# EAGLE design scematics (EAGLE 9.6.2)
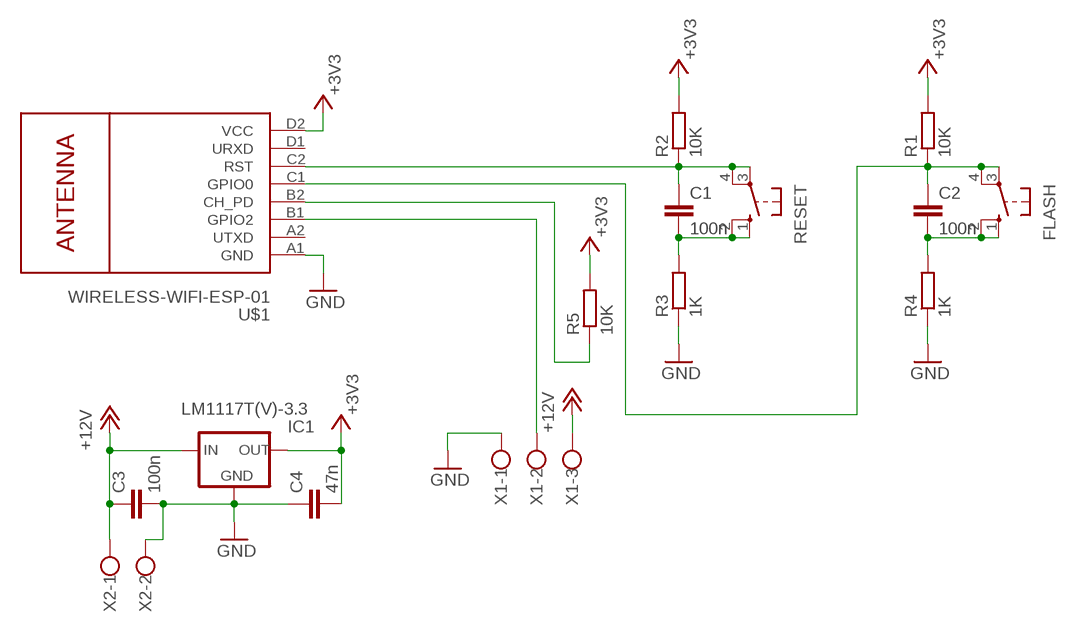
[diagram p0: schematic, sheet 1]

## Parts
C1  100n  C-EU050-030X075  [C050-030X075]
C2  100n  C-EU050-030X075  [C050-030X075]
C3  100n  C-EU050-030X075  [C050-030X075]
C4  47n  C-EU050-030X075  [C050-030X075]
FLASH  10-XX  [B3F-10XX]
IC1  LM1117T(V)-3.3  [TO220V]
R1  10K  R-EU_0207/10  [0207/10]
R2  10K  R-EU_0207/10  [0207/10]
R3  1K  R-EU_0207/10  [0207/10]
R4  1K  R-EU_0207/10  [0207/10]
R5  10K  R-EU_0207/10  [0207/10]
RESET  10-XX  [B3F-10XX]
U$1  WIRELESS-WIFI-ESP-01  [WIRELESS-WIFI-ESP-01]
X1  W237-103  [W237-103]
X2  W237-102  [W237-102]

## Nets
+3V3: C4.2 IC1.2(OUT) R1.2 R2.2 R5.2 U$1.D2(VCC)
+12V: C3.1 IC1.3(IN) X1.3 X2.1
GND: C3.2 C4.1 IC1.1(GND) R3.1 R4.1 U$1.A1(GND) X1.1 X2.2
N$1: C1.1 R2.1 RESET.3(P) RESET.4(P1) U$1.C2(RST)
N$2: C1.2 R3.2 RESET.1(S) RESET.2(S1)
N$3: C2.1 FLASH.3(P) FLASH.4(P1) R1.1 U$1.C1(GPIO0)
N$4: C2.2 FLASH.1(S) FLASH.2(S1) R4.2
N$5: R5.1 U$1.B2(CH_PD)
N$6: U$1.B1(GPIO2) X1.2
Unconnected: U$1.A2(UTXD) U$1.D1(URXD)

## Library data of the parts
C1-C4 = resistor:C-EU: CAPACITOR, European symbol
FLASH RESET = switch-omron:10-XX: OMRON SWITCH; MPN: B3F-1000; OC_FARNELL: 176432; OC_NEWARK: 36M3542
IC1 = lm1117_10:LM1117?-*: 800mA Low-Dropout Linear Regulator Source: http://www.ti.com/lit/ds/symlink/lm1117-n.pdf; MF: Texas Instruments; MPN: LM1117T-3.3; OC_FARNELL: 1469056; OC_NEWARK: 13B5347
R1-R5 = resistor:R-EU_: RESISTOR, European symbol
U$1 = diy-modules:WIRELESS-WIFI-ESP-01: Wireless Wi-Fi ESP-01 Module based on ESP8266 chip Click here to find device on ebay.com <http://www.ebay.com/sch/esp8266+esp+01+transceiver>
X1 = con-wago-500:W237-103: WAGO SCREW CLAMP; MPN: 237-103; OC_FARNELL: unknown; OC_NEWARK: 18M7116
X2 = con-wago-500:W237-102: WAGO SCREW CLAMP; MPN: 237-102; OC_FARNELL: unknown; OC_NEWARK: 70K9898

## Board
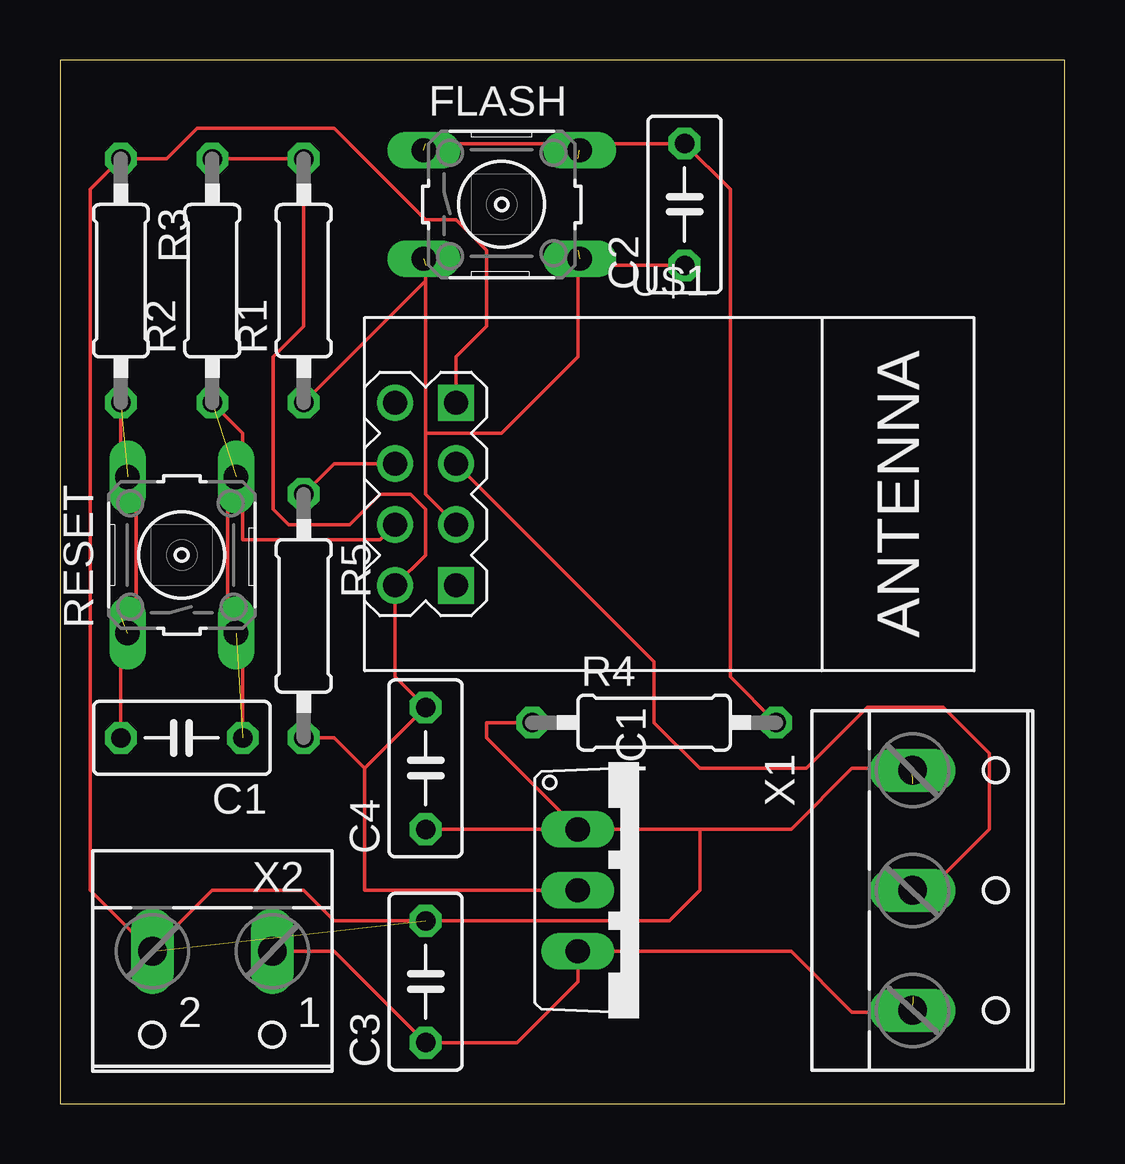
[diagram p1: board, top side]

Size 41.89 x 43.48 mm. Coordinates in mm from the lower left corner, seen from the top.
Outline: 0,0 41.89,0 41.89,43.48 0,43.48 0,0
Copper layers (1*16): Top 0.035mm / dielectric 1.5mm / Bottom 0.035mm
Design rules "default": minimum track width 6mil, minimum drill 0.35mm, track to track 6mil, track to pad 6mil, pad to pad 6mil, via to via 6mil, smd to smd 6mil, copper to edge 40mil, drill to drill 6mil, minimum pad ring 10mil, minimum via ring 8mil, stop-mask expansion 4mil, vias tented up to drill 0mil, thermal gap 10mil

### Footprints (pad centres in the part's own frame; a part is rotated, then mirrored left to right if it is on the bottom)
C050-030X075 = drill 0.813 octagon: 1 -2.54,0; 2 2.54,0
B3F-10XX = drill 1.016 long: 1 -3.251,2.261; 2 3.251,2.261; 3 -3.251,-2.261; 4 3.251,-2.261
TO220V = drill 1.016 long: 1 -2.54,-2.54; 2 0,-2.54; 3 2.54,-2.54
0207/10 = drill 0.813 octagon: 1 -5.08,0; 2 5.08,0
WIRELESS-WIFI-ESP-01 = drill 1 square: A1 -8.89,3.81; D1 -8.89,-3.81 | drill 1: A2 -11.43,3.81; B1 -8.89,1.27; B2 -11.43,1.27; C1 -8.89,-1.27; C2 -11.43,-1.27; D2 -11.43,-3.81
W237-103 = drill 1.194 long: 1 -5,-1.29; 2 0,-1.29; 3 5,-1.29
W237-102 = drill 1.194 long: 1 -2.5,-1.27; 2 2.5,-1.27

### Placement (x,y rotation side)
C1  5.08,15.24 180 top
C2  26.04,37.47 90 top
C3  15.24,5.08 90 top
C4  15.24,13.97 90 top
FLASH  18.41,37.47 0 top
IC1  24.13,8.89 270 top
R1  10.16,34.29 90 top
R2  6.35,34.29 90 top
R3  2.54,34.29 270 top
R4  24.77,15.88 0 top
R5  10.16,20.32 270 top
RESET  5.08,22.86 90 top
U$1  25.4,25.4 0 top
X1  36.83,8.89 270 top
X2  6.35,5.08 180 top

### Tracks (layer width: path | path; a pad name or v marks a point on that pad's centre or on a via)
+3V3
  Top 0.152: IC1.2 12.7,8.89 12.7,13.97 | 12.7,13.97 C4.2 13.97,17.78 U$1.D2 15.24,22.86 15.24,24.77 14.61,25.4 13.34,25.4 12.06,24.13 9.53,24.13 8.89,24.77 8.89,31.11 10.16,32.38 R1.2 R2.2 | R5.2 11.43,15.24 12.7,13.97
+12V  (2 unrouted)
  Top 0.152: 8.89,6.35 11.43,6.35 C3.1 19.05,2.54 21.59,5.08 IC1.3 30.48,6.35 33.02,3.81 35.56,3.81 35.56,4.45
GND  (2 unrouted)
  Top 0.152: C4.1 IC1.1 | IC1.1 26.67,11.43 | 26.67,11.43 30.48,11.43 33.02,13.97 35.56,13.97 35.56,13.34 | 26.67,11.43 26.67,8.89 25.4,7.62 C3.2 11.43,7.62 10.16,8.89 6.35,8.89 3.81,6.35 1.27,8.89 1.27,38.1 R3.1 | IC1.1 17.78,15.24 17.78,15.88 R4.1 | R3.1 3.17,39.37 | U$1.A1 16.51,31.11 17.78,32.38 17.78,35.56 16.51,36.83 15.24,36.83 11.43,40.64 5.71,40.64 4.45,39.37 R3.1
N$1  (2 unrouted)
  Top 0.152: R2.1 7.62,27.94 7.62,26.04 | C1.1 7.62,19.68 6.99,20.32 6.99,26.04 7.62,26.04 | 7.62,26.04 7.62,23.5 13.34,23.5 U$1.C2
N$2  (2 unrouted)
  Top 0.152: 2.54,20.32 2.54,19.68 | 2.54,19.68 C1.2 | R3.2 2.54,26.04 3.17,26.04 3.17,19.68 2.54,19.68
N$3  (2 unrouted)
  Top 0.152: R1.1 15.24,34.29 | 15.24,34.29 15.24,34.92 | 21.59,34.92 C2.1 | 21.59,34.92 21.59,35.56 | 15.24,34.29 15.24,27.94 | 15.24,27.94 18.41,27.94 21.59,31.11 21.59,34.92 | 15.24,27.94 15.24,25.4 U$1.C1
N$4  (2 unrouted)
  Top 0.152: 21.59,40.01 C2.2 27.94,38.1 27.94,17.78 R4.2 | 21.59,40.01 15.24,40.01 | 21.59,39.37 21.59,40.01
N$5
  Top 0.152: R5.1 11.43,26.67 U$1.B2
N$6  (1 unrouted)
  Top 0.152: U$1.B1 24.77,18.41 24.77,15.88 26.67,13.97 31.11,13.97 33.66,16.51 36.83,16.51 38.73,14.61 38.73,11.43 36.2,8.89 35.56,8.89